# Altium schematic sheet [08] - Power and DebugLog.SchDoc: =ProjectName
size A4; CheckedBy: Ven; Author: Ven; CompanyName: HUST; Revision: V.1.0
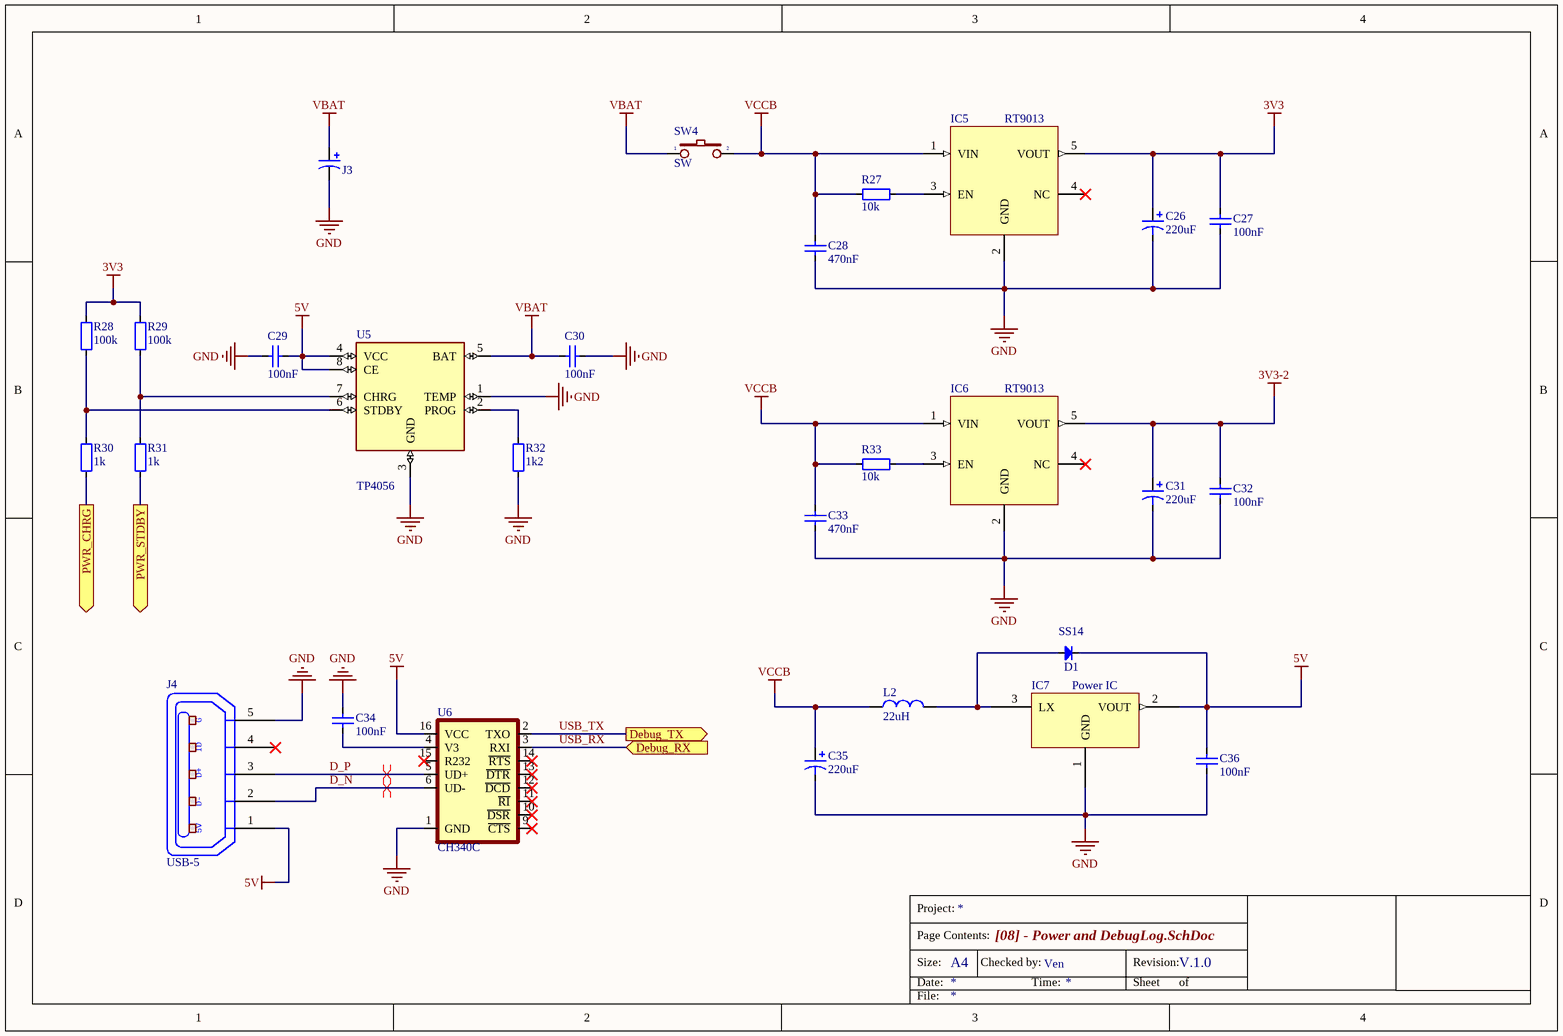
[diagram p0: [08] - Power and DebugLog.SchDoc]

## Parts
C26  220uF  [CAP_TANTALUM_3216]
C27  100nF  [CAP_0603]
C28  470nF  [CAP_0603]
C29  100nF  [CAP_0603]
C30  100nF  [CAP_0603]
C31  220uF  [CAP_TANTALUM_3216]
C32  100nF  [CAP_0603]
C33  470nF  [CAP_0603]
C34  100nF  [CAP_0603]
C35  220uF  [CAP_TANTALUM_3216]
C36  100nF  [CAP_0603]
D1  SS14  [DO-214AC(SMA)]
IC5  RT9013  [SOT23-5]
IC6  RT9013  [SOT23-5]
IC7  Power IC  [SOT-89-3]
J3  CAP_TAN_SMD  [CAP_7343]  (value not drawn)
J4  USB-5  [USB-M1]
L2  22uH  [L-SMD-M-7.3x4.5]
R27  10k  [RES-SMD-0603]
R28  100k  [RES-SMD-0603]
R29  100k  [RES-SMD-0603]
R30  1k  [RES-SMD-0603]
R31  1k  [RES-SMD-0603]
R32  1k2  [RES-SMD-0603]
R33  10k  [RES-SMD-0603]
SW4  SW  [SW2]
U5  TP4056  [TP4056]
U6  CH340C  [SO016]

## Ports
Debug_RX (in), Debug_TX (out), PWR_CHRG (out), PWR_STDBY (out)

## Nets
3V3: C26.1 C27.1 IC5.5(VOUT) R28.1 R29.1
3V3-2: C31.1 C32.1 IC6.5(VOUT)
5V: C29.1 C36.1 D1.2(K) IC7.2(VOUT) J4.1(P1) U5.4(VCC) U5.8(CE) U6.16(VCC)
GND: C26.2 C27.2 C28.2 C29.2 C30.1 C31.2 C32.2 C33.2 C34.1 C35.2 C36.2 IC5.2(GND) IC6.2(GND) IC7.1(GND) J3.2 J4.5(P5) R32.1 U5.1(TEMP) U5.3(GND) U6.1(GND)
VBAT: C30.2 J3.1 SW4.1 U5.5(BAT)
VCCB: C28.1 C33.1 C35.1 IC5.1(VIN) IC6.1(VIN) L2.1 R27.2 R33.2 SW4.2
D_N: J4.2(P2) U6.6(UD-)
D_P: J4.3(P3) U6.5(UD+)
PWR_CHRG: R30.2 ; port PWR_CHRG
PWR_STDBY: R31.2 ; port PWR_STDBY
USB_RX: U6.3(RXI) ; port Debug_RX
USB_TX: U6.2(TXO) ; port Debug_TX
NetC34_2: C34.2 U6.4(V3)
NetD1_1: D1.1(A) IC7.3(LX) L2.2
NetIC5_3: IC5.3(EN) R27.1
NetIC6_3: IC6.3(EN) R33.1
NetR28_2: R28.2 R30.1 U5.6(STDBY)
NetR29_2: R29.2 R31.1 U5.7(CHRG)
NetR32_2: R32.2 U5.2(PROG)

Not connected (* = marked no-connect by the designer): IC5 4(NC)*; IC6 4(NC)*; J4 4(P4)*; U6 9(~{CTS})* 10(~{DSR})* 11(~{RI})* 12(~{DCD})* 13(~{DTR})* 14(~{RTS})* 15(R232)*

## Layout directives
differential pair: D_N, D_P

## Notes on the sheet
- Project:
- Page Contents:
- Size:
- Date:
- A4
- Checked by:
- Time:
- Revision:
- Sheet
- of
- File:
- (in symbol USB-5) G; ID; D+; D-; 5V

## Library data of the parts
C26 C31 C35 = Cap Pol: Polarized Capacitor (Axial); Published: 8-Jun-2000; LatestRevisionDate: 17-Jul-2002; LatestRevisionNote: Re-released for DXP Platform.; PackageReference: POLAR0.8; Publisher: Altium Limited
C27-C30 C32-C34 C36 = CapSMD: Capacitor; Value: 33p; Published: 8-Jun-2000; LatestRevisionDate: 17-Jul-2002; LatestRevisionNote: Re-released for DXP Platform.; PackageReference: RAD-0.3; Publisher: Altium Limited
D1 = Diode SMD: Code - JEDEC: DO-214-AB; Value: 1N5007; Published: 8-Jun-2000; Revision: July-2002: Re-released for DXP Platform.; Publisher: Altium Limited
IC5 IC6 = RT9013: RT9013-33GB IC REG LINEAR 3.3V 500mA SOT23-5
IC7 = CE8301A: Boost 5V IC 500mA
J3 = CAP_TAN_SMD: Polazied Tantalum Capacitor
J4 = USB-5: Manufacturer: FCI; Manufacturer Part Number: 10118193-0001LF; Connector Type: USB - micro B; Number of Contacts: 5; Gender: Receptacle; Specifications: USB 2.0; .Creator: MM; .Checked PCB: RF; Supplier 1: Digi-Key; RoHS: RoHS Compliant; Category: Connectors, Interconnects; Stock 1: 28642; Pricing 1: 1=0.46, 10=0.433, 25=0.3712, 50=0.3156, 100=0.3032, 250=0.27224, 500=0.25988 (USD); Packaging: Cut Tape (CT); Mounting Type: Surface Mount, Right Angle, Horizontal; Features: Shielded, Solder Retention; Ingress Protection: -; ComponentLink1URL: http://portal.fciconnect.com/Comergent//fci/drawing/10118193.pdf; ComponentLink1Description: http://portal.fciconnect.com/Comergent//fci/drawing/10118193.pdf; Supplier Part Number 1: 609-4616-1-ND; .Checked SCH: MM
L2 = L1: Inductor; Value: 150 mH
R27-R33 = Resistor - SMD: Resistor; Manufacturer: Generic Components; Class: Passive; Published: 08/06/2000; Publisher: Altium Hobart Technology Centre
SW4 = SW2: Switch button 2 pin; Value: SW chip 2 pin
U5 = TP4056: Complete single cell Li-Ion battery with a constant current / constant voltage linear charger
U6 = CH340C: USB to serial chip CH340; MF: WCH; Package: Package; Check_prices: https://www.snapeda.com/parts/CH340C/WCH/view-part/5428851/?ref=eda; Value: *; Price: None; MP: CH340C; Availability: Unavailable; SnapEDA_Link: https://www.snapeda.com/parts/CH340C/WCH/view-part/5428851/?ref=snap